# EAGLE design version_2 (EAGLE 6.1)
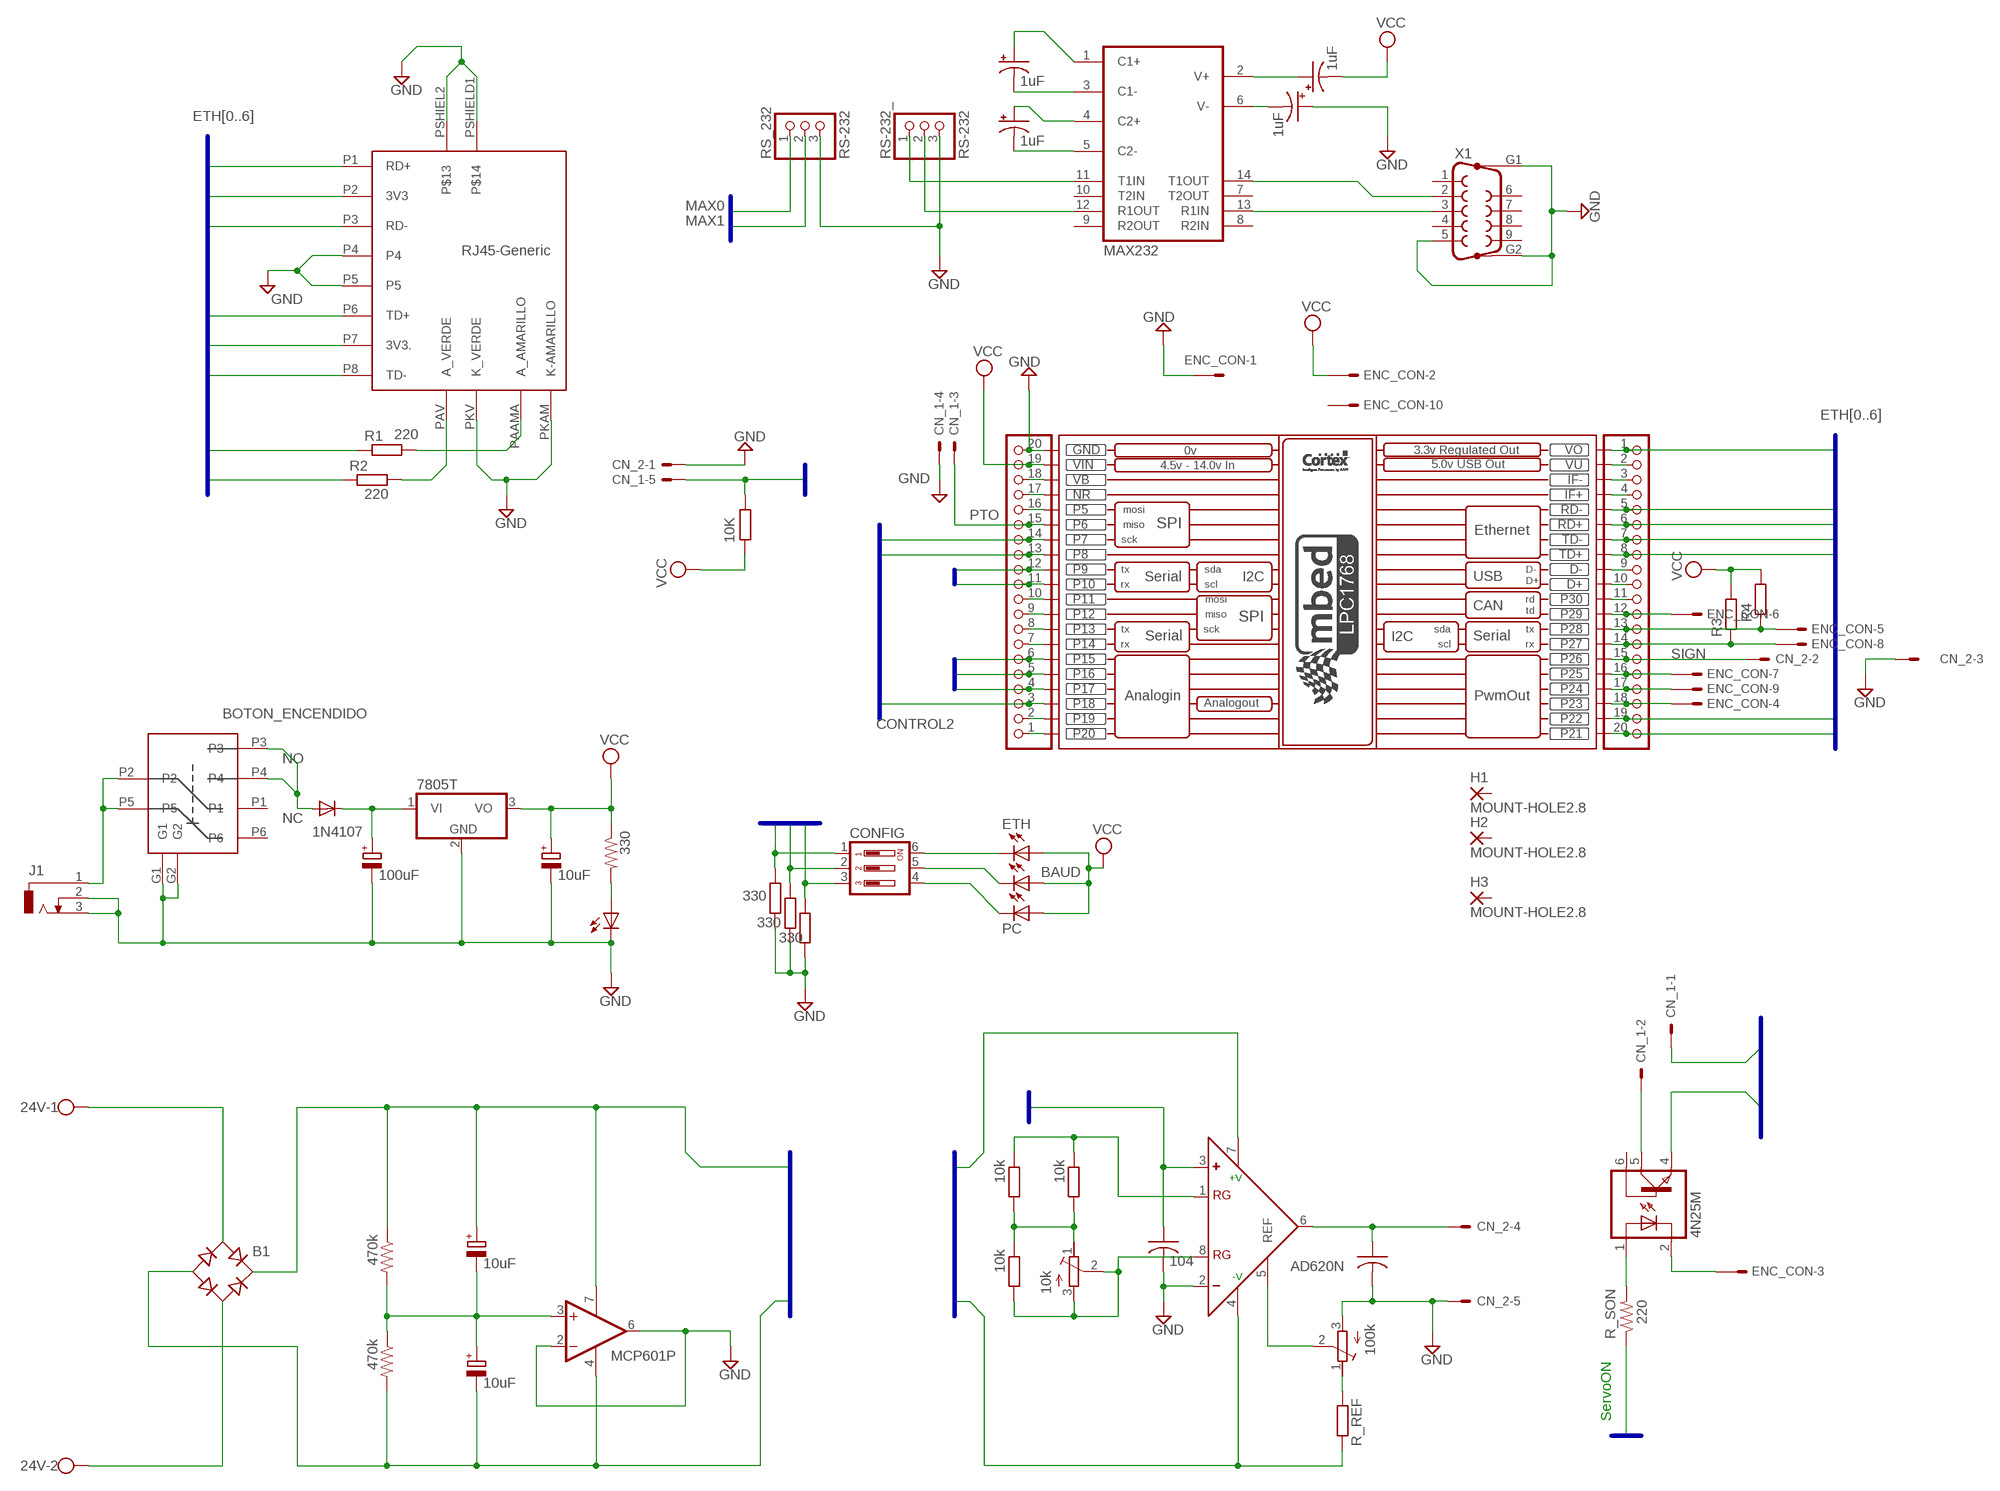
[diagram p0: schematic, sheet 1]

## Parts
24V  W237-02P  [W237-132]
B1  RB1A  [RB1A]
BAUD  LED3MM  [LED3MM]
C1_9V  100uF  CPOL-EUTT5D7  [TT5D7]
C1_+24  10uF  CPOL-EUTT5D7  [TT5D7]
C1_MAX  1uF  CPOL-USE2,5-6E  [E2,5-6E]
C2_0V  10uF  CPOL-EUTT5D7  [TT5D7]
C2_9V  10uF  CPOL-EUTT5D7  [TT5D7]
C2_MAX  1uF  CPOL-USE2,5-6E  [E2,5-6E]
C3_AOUT  C-US025-024X044  [C025-024X044]
C3_MAX  1uF  CPOL-USE2,5-6E  [E2,5-6E]
C4_MAX  1uF  CPOL-USE2,5-6E  [E2,5-6E]
C5_AOUT  104  C-US025-024X044  [C025-024X044]
CN_1  1  22-23-2051  [22-23-2051]
CN_2  2  22-23-2051  [22-23-2051]
CONFIG  DIP03YL  [DIP03YL]
D1_INPUT  1N4107  1N4148DO35-10  [DO35-10]
ENC_CON  057-010-1  [057-010-1]
ETH  LED3MM  [LED3MM]
H1  MOUNT-HOLE2.8  2,54/0,8  [2,54/0,8]
H2  MOUNT-HOLE2.8  2,54/0,8  [2,54/0,8]
H3  MOUNT-HOLE2.8  2,54/0,8  [2,54/0,8]
IC1  MAX232  [DIL16]
IC2  7805T  [TO220H]
IC3  MCP601P  [DIL08]
IC4  AD620N  [DIL08]
J1  DCJ0303  [DCJ0303]
JP_LEFT  PINHD-1X20  [1X20]
JP_RIGHT  PINHD-1X20  [1X20]
KIT1  MBED_NXP_LPC1768  [MBED-KIT]
OK1  4N25M  [DIL06]
PC  LED3MM  [LED3MM]
POT_G  10k  R-TRIMMT93XB  [RTRIMT93XB]
POT_REF  100k  R-TRIMMT93XB  [RTRIMT93XB]
PWR_LED  LED3MM  [LED3MM]
PWR_LED_R  330  R-US_0207/15  [0207/15]
R1  220  R-EU_0207/15  [0207/15]
R1_DIV  470k  R-US_0207/10  [0207/10]
R1_G  10k  R-EU_0207/2V  [0207/2V]
R2  220  R-EU_0207/15  [0207/15]
R2_DIV  470k  R-US_0207/10  [0207/10]
R2_G  10k  R-EU_0207/2V  [0207/2V]
R3  R-EU_0207/15  [0207/15]
R3_G  10k  R-EU_0207/2V  [0207/2V]
R4  R-EU_0207/15  [0207/15]
R13  330  R-EU_0207/15  [0207/15]
R14  330  R-EU_0207/15  [0207/15]
R15  330  R-EU_0207/15  [0207/15]
R16_ALM  10K  R-EU_0207/12  [0207/12]
R_REF  R-EU_0207/2V  [0207/2V]
R_SON  220  R-US_0207/7  [0207/7]
RS-232_  RS-232  PINHD-1X3  [1X03]
RS_232  RS-232  PINHD-1X3  [1X03]
U$1  RJ-45-GENERIC  [RJ45-GENERIC]
U$2  BOTON_ENCENDIDO  [BOTON_ENCNEDIDO]
X1  F09HP  [F09HP]

## Nets
24V0: B1.- C2_0V.- IC3.4(V-) IC4.4(-V) OK1.4(EMI) R2_DIV.2 R_REF.2
24V1: B1.+ C1_+24.+ CN_1.1 IC3.7(V+) IC4.7(+V) R1_DIV.1
CONFIG0: CONFIG.1 JP_LEFT.6 KIT1.P$15(P15) R15.2
CONFIG1: CONFIG.2 JP_LEFT.5 KIT1.P$16(P16) R14.2
CONFIG2: CONFIG.3 JP_LEFT.4 KIT1.P$17(P17) R13.2
CONTROL0: JP_LEFT.14 KIT1.P$7(P7) R_SON.1
CONTROL1: CN_1.5 JP_LEFT.13 KIT1.P$8(P8) R16_ALM.1
CONTROL2: C5_AOUT.1 IC4.3(+) JP_LEFT.3 KIT1.P$18(P18)
ETH0: JP_RIGHT.1 KIT1.VOUT(VO) U$1.P2(3V3) U$1.P7(3V3.)
ETH1: JP_RIGHT.5 KIT1.RD- U$1.P3(RD-)
ETH2: JP_RIGHT.6 KIT1.RD+ U$1.P1(RD+)
ETH3: JP_RIGHT.7 KIT1.TD- U$1.P8(TD-)
ETH4: JP_RIGHT.8 KIT1.TD+ U$1.P6(TD+)
ETH5: JP_RIGHT.19 KIT1.P$22(P22) R1.1
ETH6: JP_RIGHT.20 KIT1.P$21(P21) R2.1
GND: C1_9V.- C2_9V.- C3_AOUT.2 C3_MAX.+ C5_AOUT.2 CN_1.4 CN_2.1 CN_2.3 CN_2.5 ENC_CON.1 IC2.2(GND) IC3.2(-IN) IC3.6(OUT) IC4.2(-) J1.2 J1.3 JP_LEFT.20 KIT1.GND POT_REF.3(E) PWR_LED.K(C) R13.1 R14.1 R15.1 RS-232_.3 RS_232.3 U$1.P4 U$1.P5 U$1.PKAM(K-AMARILLO) U$1.PKV(K_VERDE) U$1.PSHIEL2 U$1.PSHIELD1 U$2.G1 U$2.G2 X1.5 X1.G1 X1.G2
MAX0: JP_LEFT.12 KIT1.P$9(P9) RS_232.1
MAX1: JP_LEFT.11 KIT1.P$10(P10) RS_232.2
N$1: 24V.1 B1.AC1
N$2: 24V.2 B1.AC2
N$3: C1_+24.- C2_0V.+ IC3.3(+IN) R1_DIV.2 R2_DIV.1
N$4: CN_1.2 OK1.5(COL)
N$5: JP_RIGHT.2 KIT1.VU
N$6: C3_AOUT.1 CN_2.4 IC4.6(OUT)
N$7: JP_RIGHT.3 KIT1.IF-
N$8: POT_REF.1(A) R_REF.1
N$9: IC4.1(RG) R1_G.1 R3_G.1
N$10: POT_G.1(A) R1_G.2 R2_G.1 R3_G.2
N$11: IC4.8(RG) POT_G.2(S) POT_G.3(E) R2_G.2
N$12: D1_INPUT.A U$2.P3 U$2.P4
N$14: JP_RIGHT.4 KIT1.IF+
N$15: IC4.5(REF) POT_REF.2(S)
N$16: JP_RIGHT.11 KIT1.P$30(P30)
N$18: J1.1 U$2.P2 U$2.P5
N$20: OK1.1(A) R_SON.2
N$21: C1_9V.+ D1_INPUT.C IC2.1(VI)
N$22: IC1.11(T1IN) RS-232_.1
N$23: IC1.12(R1OUT) RS-232_.2
N$24: CONFIG.6 ETH.K(C)
N$25: BAUD.K(C) CONFIG.5
N$26: CONFIG.4 PC.K(C)
N$31: JP_RIGHT.9 KIT1.D-
N$32: JP_RIGHT.10 KIT1.D+
N$33: C1_MAX.+ IC1.1(C1+)
N$34: C1_MAX.- IC1.3(C1-)
N$35: C2_MAX.- IC1.5(C2-)
N$36: C2_MAX.+ IC1.4(C2+)
N$37: C4_MAX.+ IC1.2(V+)
N$38: C3_MAX.- IC1.6(V-)
N$39: ENC_CON.5 JP_RIGHT.13 KIT1.P$28(P28) R4.1
N$40: IC1.14(T1OUT) X1.2
N$41: IC1.13(R1IN) X1.3
N$42: ENC_CON.4 JP_RIGHT.18 KIT1.P$23(P23)
N$44: ENC_CON.8 JP_RIGHT.14 KIT1.P$27(P27) R3.1
N$45: ENC_CON.7 JP_RIGHT.16 KIT1.P$25(P25)
N$46: R1.2 U$1.PAAMA(A_AMARILLO)
N$47: ENC_CON.9 JP_RIGHT.17 KIT1.P$24(P24)
N$48: JP_LEFT.18 KIT1.VB
N$49: JP_LEFT.17 KIT1.NR
N$50: JP_LEFT.16 KIT1.P$5(P5)
N$52: R2.2 U$1.PAV(A_VERDE)
N$53: JP_LEFT.10 KIT1.P$11(P11)
N$54: JP_LEFT.9 KIT1.P$12(P12)
N$55: JP_LEFT.8 KIT1.P$13(P13)
N$57: JP_LEFT.7 KIT1.P$14(P14)
N$58: ENC_CON.3 OK1.2(C)
N$59: JP_LEFT.2 KIT1.P$19(P19)
N$60: JP_LEFT.1 KIT1.P$20(P20)
N$61: PWR_LED.A PWR_LED_R.2
PTO: CN_1.3 JP_LEFT.15 KIT1.P$6(P6)
SIGN: CN_2.2 JP_RIGHT.15 KIT1.P$26(P26)
SIGN+: ENC_CON.6 JP_RIGHT.12 KIT1.P$29(P29)
VCC: BAUD.A C2_9V.+ C4_MAX.- ENC_CON.2 ETH.A IC2.3(VO) JP_LEFT.19 KIT1.VIN PC.A PWR_LED_R.1 R3.2 R4.2 R16_ALM.2
Unconnected: ENC_CON.10 H1.1(P) H2.1(P) H3.1(P) IC1.7(T2OUT) IC1.8(R2IN) IC1.9(R2OUT) IC1.10(T2IN) OK1.6(BAS) U$2.P1 U$2.P6 X1.1 X1.4 X1.6 X1.7 X1.8 X1.9

## Buses
ETH[0..6]
MAX[0..1]
CONTROL[0..2]
24V[0..1]
CONFIG[0..2]

## Notes on the sheet
- ServoON

## Power pins joined to a net without a drawn wire
GND: IC1.15(GND)
VCC: IC1.16(VCC)

## Library data of the parts
24V = con-wago-508:W237-02P: WAGO SREW CLAMP
B1 = rectifier:RB1A: RECTIFIER 1 A
BAUD ETH PC PWR_LED = led:LED: LED OSRAM: - CHIPLED LG R971, LG N971, LY N971, LG Q971, LY Q971, LO R971, LY R971 LH N974, LH R974 LS Q976, LO Q976, LY Q976 LO Q996 - Hyper CHIPLED LW Q18S LB Q993, LB Q99A, LB R99A - SideLED LS A670, LO A670, LY A670, LG A670, LP A670 LB A673, LV A673, LT A673, LW A673 LH A674 LY A675 LS A676, LA A676, LO A676, LY A676, LW A676 LS A679, LY A679, LG A679 - Hyper Micro SIDELED® LS Y876, LA Y876, LO Y876, LY Y876 LT Y87S - SmartLED LW L88C, LW L88S LB L89C, LB L89S, LG L890 LS L89K, LO L89K, LY L89K LS L896, LA L896, LO L896, LY L896 - TOPLED LS T670, LO T670, LY T670, LG T670, LP T670 LSG T670, LSP T670, LSY T670, LOP T670, LYG T670 LG T671, LOG T671, LSG T671 LB T673, LV T673, LT T673, LW T673 LH T674 LS T676, LA T676, LO T676, LY T676, LB T676, LH T676, LSB T676, LW T676 LB T67C, LV T67C, LT T67C, LS T67K, LO T67K, LY T67K, LW E67C LS E67B, LA E67B, LO E67B, LY E67B, LB E67C, LV E67C, LT E67C LW T67C LS T679, LY T679, LG T679 LS T770, LO T770, LY T770, LG T770, LP T770 LB T773, LV T773, LT T773, LW T773 LH T774 LS E675, LA E675, LY E675, LS T675 LS T776, LA T776, LO T776, LY T776, LB T776 LHGB T686 LT T68C, LB T68C - Hyper Mini TOPLED® LB M676 - Mini TOPLED Santana® LG M470 LS M47K, LO M47K, LY M47K Source: http://www.osram.convergy.de LUXEON: - LUMILED® LXK2-PW12-R00, LXK2-PW12-S00, LXK2-PW14-U00, LXK2-PW14-V00 LXK2-PM12-R00, LXK2-PM12-S00, LXK2-PM14-U00 LXK2-PE12-Q00, LXK2-PE12-R00, LXK2-PE12-S00, LXK2-PE14-T00, LXK2-PE14-U00 LXK2-PB12-K00, LXK2-PB12-L00, LXK2-PB12-M00, LXK2-PB14-N00, LXK2-PB14-P00, LXK2-PB14-Q00 LXK2-PR12-L00, LXK2-PR12-M00, LXK2-PR14-Q00, LXK2-PR14-R00 LXK2-PD12-Q00, LXK2-PD12-R00, LXK2-PD12-S00 LXK2-PH12-R00, LXK2-PH12-S00 LXK2-PL12-P00, LXK2-PL12-Q00, LXK2-PL12-R00 Source: www.luxeon.com KINGBRIGHT: KA-3528ASYC Source: www.kingbright.com
C1_9V C1_+24 C2_0V C2_9V = rcl:CPOL-EU: POLARIZED CAPACITOR, European symbol
C1_MAX C2_MAX C3_MAX C4_MAX = rcl:CPOL-US: POLARIZED CAPACITOR, American symbol
C3_AOUT C5_AOUT = rcl:C-US: CAPACITOR, American symbol
CN_1 CN_2 = con-molex:22-23-2051: .100" (2.54mm) Center Header - 5 Pin
CONFIG = switch-dil:DIP03YL: DIL/CODE SWITCH
D1_INPUT = diode:1N4148: DIODE high speed (Philips)
ENC_CON = con-panduit:057-010-: CONNECTOR 10-pin series 057 contact pc board low profile headers; OC_FARNELL: unknown; OC_NEWARK: unknown
H1-H3 = wirepad:2,54/0,8: THROUGH-HOLE PAD
IC1 = maxim:MAX232: RS232 TRANSEIVER
IC2 = linear:78*: Positive VOLTAGE REGULATOR Source: http://cache.national.com/ds/LM/LM78L05.pdf http://www.fairchildsemi.com/ds/LM/LM7805.pdf
IC3 = linear:MCP601: Single Op Amp 2.7V to 6.0V Single Supply CMOS Source: http://ww1.microchip.com/downloads/en/DeviceDoc/21314g.pdf
IC4 = analog-devices:AD620: Low Cost, Low Power, Instrumentation Amplifier Source: http://www.analog.com/UploadedFiles/Data_Sheets/37793330023930AD620_e.pdf
J1 = con-jack:DCJ0303: DC POWER JACK Source: DCJ0303.pdf
JP_LEFT JP_RIGHT = pinhead:PINHD-1X20: PIN HEADER
KIT1 = MBED_v2.1:MBED_NXP_LPC1768: Mbed LPC1768 - ARM CORTEX v2.1 * Schematic symbol is now placed in eagles's default raster. *The pads diameter are suitable for routing between mbed pins * mbed pads are 0.8 mm drill diameter. --------------------------------------------- Created by: Mohamed Yousry *Alexandria, Egypt *Email: mohamed.yousry@ieeegoldegypt.org
OK1 = optocoupler:4N*?M: General Purpose 6-Pin Phototransistor Optocouplers Source: http://www.fairchildsemi.com/ds/4N/4N35-M.pdf
POT_G POT_REF = rcl:R-TRIMM: Trimm resistor
PWR_LED_R R_SON = rcl:R-US_: RESISTOR, American symbol
R1 R1_G R2 R2_G R3 R3_G R4 R13-R15 R16_ALM R_REF = rcl:R-EU_: RESISTOR, European symbol
R1_DIV R2_DIV = resistor:R-US_: RESISTOR, American symbol
RS-232_ RS_232 = pinhead:PINHD-1X3: PIN HEADER
U$1 = RJ45:RJ-45-GENERIC
U$2 = Boton_Encendido:BOTON_ENCENDIDO
X1 = con-subd:F09HP: SUB-D

## Board
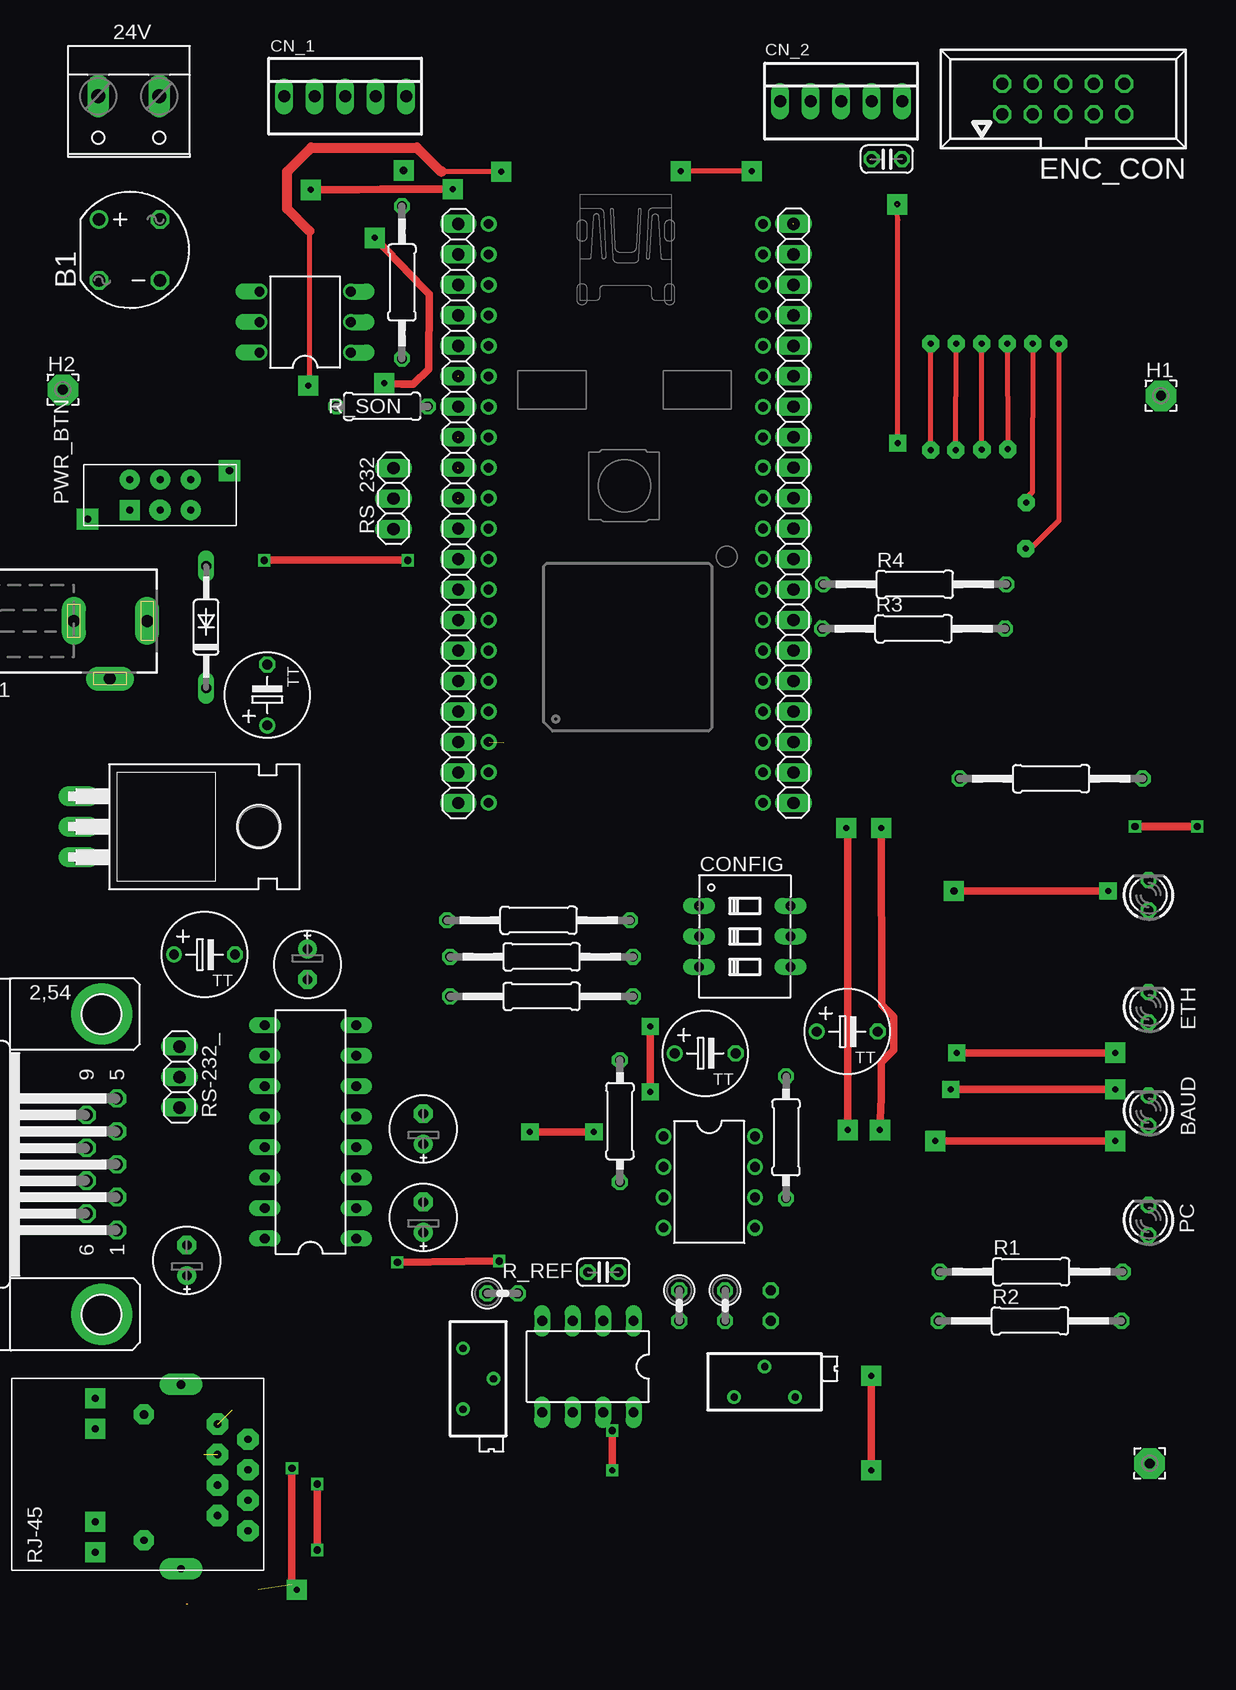
[diagram p1: board, top side]
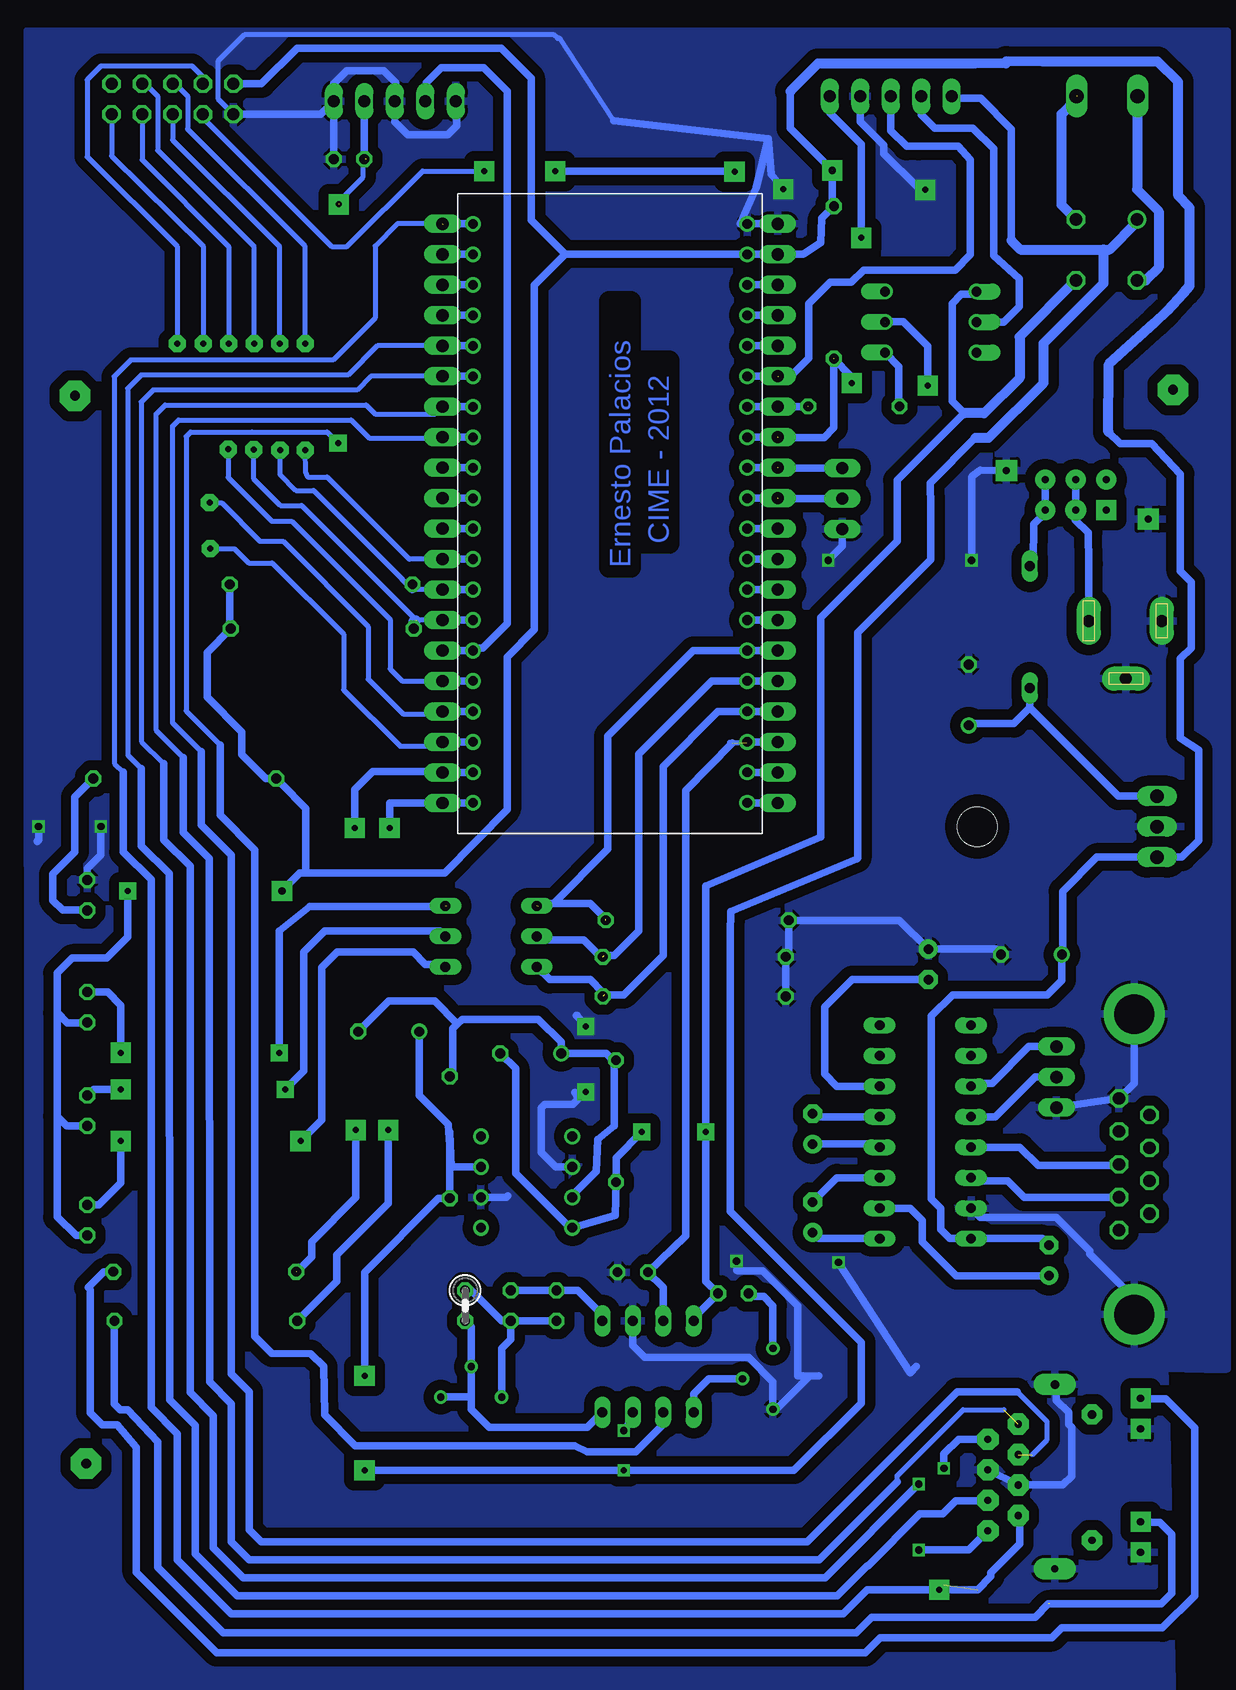
[diagram p2: board, bottom side, seen from below]

No outline drawn. Coordinates in mm, seen from the top.
Copper layers (1*16): Top 0.035mm / dielectric 1.5mm / Bottom 0.035mm
Design rules: minimum track width 10mil, minimum drill 24mil, track to track 34mil, track to pad 34mil, pad to pad 34mil, via to via 34mil, smd to smd 34mil, copper to edge 40mil, drill to drill 8mil, minimum pad ring 10mil, minimum via ring 8mil, stop-mask expansion 4mil, vias tented up to drill 0mil, thermal gap 10mil

### Footprints (pad centres in the part's own frame; a part is rotated, then mirrored left to right if it is on the bottom)
W237-132 = drill 1.194 long: 1 -2.54,-0.635; 2 2.54,-0.635
RB1A = drill 1.016: + -2.54,2.54 | drill 1.016 octagon: - 2.54,-2.54; AC1 2.54,2.54; AC2 -2.54,-2.54
LED3MM = drill 0.813 octagon: A -1.27,0; K 1.27,0
TT5D7 = drill 0.813: + -2.54,0 | drill 0.813 octagon: - 2.54,0
E2,5-6E = drill 0.813 pad 1.575: + -1.27,0 | drill 0.813 pad 1.575 octagon: - 1.27,0
C025-024X044 = drill 0.813 octagon: 1 -1.27,0; 2 1.27,0
22-23-2051 = drill 1 long: 1 -5.08,0; 2 -2.54,0; 3 0,0; 4 2.54,0; 5 5.08,0
DIP03YL = drill 0.813 long: 1 -2.54,-3.81; 2 0,-3.81; 3 2.54,-3.81; 4 2.54,3.81; 5 0,3.81; 6 -2.54,3.81
DO35-10 = drill 0.813 long: A 5.08,0; C -5.08,0
057-010-1 = drill 1 octagon: 1 -5.08,-1.27; 2 -5.08,1.27; 3 -2.54,-1.27; 4 -2.54,1.27; 5 0,-1.27; 6 0,1.27; 7 2.54,-1.27; 8 2.54,1.27; 9 5.08,-1.27; 10 5.08,1.27
2,54/0,8 = drill 0.813 pad 2.54 octagon: 1 0,0
DIL16 = drill 0.813 long: 1 -8.89,-3.81; 2 -6.35,-3.81; 3 -3.81,-3.81; 4 -1.27,-3.81; 5 1.27,-3.81; 6 3.81,-3.81; 7 6.35,-3.81; 8 8.89,-3.81; 9 8.89,3.81; 10 6.35,3.81; 11 3.81,3.81; 12 1.27,3.81; 13 -1.27,3.81; 14 -3.81,3.81; 15 -6.35,3.81; 16 -8.89,3.81
TO220H = drill 1.118 long: 1 -2.54,-10.16; 2 0,-10.16; 3 2.54,-10.16 | hole 3.302: 0,4.826
DIL08 = drill 0.813 pad 1.27: 1 -3.81,-3.81; 2 -1.27,-3.81; 3 1.27,-3.81; 4 3.81,-3.81; 5 3.81,3.81; 6 1.27,3.81; 7 -1.27,3.81; 8 -3.81,3.81
DIL08' = drill 0.813 long: 1 -3.81,-3.81; 2 -1.27,-3.81; 3 1.27,-3.81; 4 3.81,-3.81; 5 3.81,3.81; 6 1.27,3.81; 7 -1.27,3.81; 8 -3.81,3.81
DCJ0303 = drill 1 pad 2 long: 1 0,3.1; 2 4.8,0; 3 0,-3
1X20 = drill 1.016 long: 1 -24.13,0; 2 -21.59,0; 3 -19.05,0; 4 -16.51,0; 5 -13.97,0; 6 -11.43,0; 7 -8.89,0; 8 -6.35,0; 9 -3.81,0; 10 -1.27,0; 11 1.27,0; 12 3.81,0; 13 6.35,0; 14 8.89,0; 15 11.43,0; 16 13.97,0; 17 16.51,0; 18 19.05,0; 19 21.59,0; 20 24.13,0
MBED-KIT = drill 0.8: D+ 11.43,1.27; D- 11.43,3.81; GND -11.43,24.13; IF+ 11.43,16.51; IF- 11.43,19.05; NR -11.43,16.51; P$5 -11.43,13.97; P$6 -11.43,11.43; P$7 -11.43,8.89; P$8 -11.43,6.35; P$9 -11.43,3.81; P$10 -11.43,1.27; P$11 -11.43,-1.27; P$12 -11.43,-3.81; P$13 -11.43,-6.35; P$14 -11.43,-8.89; P$15 -11.43,-11.43; P$16 -11.43,-13.97; P$17 -11.43,-16.51; P$18 -11.43,-19.05; P$19 -11.43,-21.59; P$20 -11.43,-24.13; P$21 11.43,-24.13; P$22 11.43,-21.59; P$23 11.43,-19.05; P$24 11.43,-16.51; P$25 11.43,-13.97; P$26 11.43,-11.43; P$27 11.43,-8.89; P$28 11.43,-6.35; P$29 11.43,-3.81; P$30 11.43,-1.27; RD+ 11.43,11.43; RD- 11.43,13.97; TD+ 11.43,6.35; TD- 11.43,8.89; VB -11.43,19.05; VIN -11.43,21.59; VOUT 11.43,24.13; VU 11.43,21.59
DIL06 = drill 0.813 offset: 1 -2.54,-3.81; 2 0,-3.81; 3 2.54,-3.81; 4 2.54,3.81; 5 0,3.81; 6 -2.54,3.81
RTRIMT93XB = drill 0.61: 1 1.27,-2.54; 2 -1.27,0; 3 1.27,2.54
0207/15 = drill 0.813 octagon: 1 -7.62,0; 2 7.62,0
0207/10 = drill 0.813 octagon: 1 -5.08,0; 2 5.08,0
0207/2V = drill 0.813 octagon: 1 -1.27,0; 2 1.27,0
0207/12 = drill 0.813 octagon: 1 -6.35,0; 2 6.35,0
0207/7 = drill 0.813 octagon: 1 -3.81,0; 2 3.81,0
1X03 = drill 1.016 long: 1 -2.54,0; 2 0,0; 3 2.54,0
RJ45-GENERIC = drill 0.6 pad 1.778 octagon: P1 12.2,19.685; P2 10.93,17.145; P3 9.66,19.685; P4 8.39,17.145; P5 7.12,19.685; P6 5.85,17.145; P7 4.58,19.685; P8 3.31,17.145 | drill 0.6 pad 1.676 square: PAAMA 1.17,6.958; PAV 11.465,6.958; PKAM 3.71,6.958; PKV 14.005,6.958 | drill 0.6 pad 1.778 long: PSHIEL2 15.375,14.105 | drill 0.7 pad 1.778 long: PSHIELD1 0,14.105 | drill 0.7 pad 1.676 octagon: PSTAND 2.5,11.008 | drill 0.6 pad 1.676 octagon: PSTAND2 13,11.008
BOTON_ENCNEDIDO = drill 0.6 pad 1.778 square: G1 -2.019,6.039; G2 2.018,-5.785 | drill 0.6 pad 1.676 square: P1 -1.27,2.54 | drill 0.6 pad 1.778: P2 -1.27,0 | drill 0.6 pad 1.676: P3 -1.27,-2.54; P4 1.27,-2.54; P5 1.27,0; P6 1.27,2.54
F09HP = drill 1.016 octagon: 1 -5.486,-1.27; 2 -2.743,-1.27; 3 0,-1.27; 4 2.743,-1.27; 5 5.486,-1.27; 6 -4.115,1.27; 7 -1.372,1.27; 8 1.372,1.27; 9 4.115,1.27 | drill 3.302 pad 5.08: G1 -12.522,0; G2 12.522,0

### Placement (x,y rotation side)
24V  10,126.86 180 top
B1  10.06,114.68 0 top
BAUD  94.98,42.92 90 top
C1_9V  21.54,77.58 90 top
C1_+24  69.87,49.51 0 top
C1_MAX  34.54,34.04 90 top
C2_0V  58.04,47.7 0 top
C2_9V  16.31,55.94 0 top
C2_MAX  34.54,41.4 90 top
C3_AOUT  73.17,122.24 0 top
C3_MAX  24.89,55.12 270 top
C4_MAX  14.84,30.44 90 top
C5_AOUT  49.53,29.46 0 top
CN_1  28.03,127.48 0 top
CN_2  69.36,127.07 0 top
CONFIG  61.34,57.45 270 top
D1_INPUT  16.45,83.23 90 top
ENC_CON  87.88,127.25 0 top
ETH  94.98,51.54 90 top
H1  96.01,102.52 0 top
H2  4.5,103.02 0 top
H3  95.08,13.51 0 top
IC1  25.15,41.15 90 top
IC2  15.99,66.6 270 top
IC3  58.37,36.97 270 top
IC4  AD620N  [DIL08']  48.26,21.59 180 top
J1  8.43,83.74 270 top
JP_LEFT  37.45,92.71 90 top
JP_RIGHT  65.39,92.71 270 top
KIT1  51.42,92.71 0 top
OK1  24.69,108.66 90 top
PC  94.98,33.8 90 top
POT_G  62.99,20.32 270 top
POT_REF  39.12,20.57 180 top
PWR_LED  94.98,60.89 90 top
PWR_LED_R  86.86,70.6 0 top
R1  85.2,29.5 0 top
R1_DIV  64.77,40.7 90 top
R1_G  59.69,26.67 270 top
R2  85.1,25.4 0 top
R2_DIV  50.93,42.05 270 top
R2_G  63.5,26.67 270 bottom
R3  75.4,83.1 0 top
R3_G  55.88,26.67 270 top
R4  75.5,86.8 0 top
R13  44.4,52.45 0 top
R14  44.4,55.75 0 top
R15  44.15,58.8 0 top
R16_ALM  32.77,111.97 90 top
R_REF  41.15,27.69 0 top
R_SON  31.11,101.63 180 top
RS-232_  14.22,45.72 270 top
RS_232  32.07,93.95 270 top
U$1  0.25,20.11 270 top
U$2  12.61,94.25 90 top
X1  7.74,38.45 90 top

### Tracks (layer width: path | path; a pad name or v marks a point on that pad's centre or on a via)
24V0  (via drill 0.5 pad 1.42)
  Top 0.61: v43.43,41.15 v48.77,41.15
  Bottom 0.61: OK1.4 21.11,110.97 22.16,110.97 22.92,110.2 22.92,102.08 21.91,101.06 27.5,95.47 27.5,90.39 33.85,84.04 33.85,65.75 43.43,61.67 v43.43,41.15 43.43,28.7 R_REF.2 44.45,25.65 IC4.4 | v48.77,41.15 50.93,38.99 R2_DIV.2 51.01,34.18 IC3.4 54.75,33.16 59.3,37.71 59.3,46.42 C2_0V.-
  Bottom 0.813: B1.- 17.3,107.43 17.3,104 20.24,101.06 21.91,101.06
24V1  (via drill 0.5 pad 1.02, 0.5 pad 1.68, 0.6)
  Top 0.61: v71.88,12.95 v71.88,20.83 | v50.29,16.26 v50.29,12.95
  Bottom 0.61: 20.99,99.01 24.75,95.25 24.7,93.19 24.7,88.87 30.8,82.77 30.8,63.98 30.86,63.91 41.38,59.53 41.4,57.66 41.4,34.54 30.48,23.62 30.48,18.54 36.1,12.95 v50.29,12.95 v71.88,12.95 | 64.64,38.23 64.77,41.15 R1_DIV.1 65.72,35.62 71.88,29.46 v71.88,20.83 | 64.64,38.23 63.36,38.24 IC3.7 | C1_+24.+ 67.31,49.5 67.31,44.2 64.9,41.78 64.64,38.23 | IC4.7 49.53,17.27 v50.29,16.26 | 17.97,115.45 17.97,124.72 20.55,127.3 22.77,127.3 CN_1.1
  Bottom 0.813: 17.97,115.45 17.22,114.7 10.3,114.7 | 10.3,114.7 9.8,114.7 7.52,116.98 B1.+ | 20.99,99.01 19.88,99.01 15.3,103.59 15.3,106.9 10.3,111.9 10.3,114.7
AOUT
  Bottom 0.406: 41.46,73.63 40,73.63 40,73.6
CONFIG0  (2 unrouted)
  Bottom 0.61: 51.77,58.88 53.09,60.2 56.13,60.2 | 56.13,60.2 57.15,60.2 57.4,59.94 | JP_LEFT.6 KIT1.P$15 44.48,81.28 51.6,74.16 51.6,64.73 56.13,60.2
CONFIG1  (1 unrouted)
  Bottom 0.61: JP_LEFT.5 KIT1.P$16 42.94,78.74 49.04,72.64 49.04,57.9 51.05,55.88 51.89,55.88 | R14.2 52.19,55.75 53.59,57.15 57.23,57.15 CONFIG.2
CONFIG2  (1 unrouted)
  Bottom 0.61: JP_LEFT.4 KIT1.P$17 42.43,76.2 47.01,71.63 47.01,55.86 50.29,52.58 51.89,52.58 | R13.2 52.02,52.79 53.09,53.85 56.47,53.85 CONFIG.3
CONTROL0  (1 unrouted)
  Bottom 0.61: KIT1.P$7 JP_LEFT.14 34.95,101.6
CONTROL1  (via drill 0.5 pad 1.68)  (2 unrouted)
  Top 0.61: v30.49,115.68 34.54,111.5 35.05,110.99 35,104.75 33.72,103.47 32.7,103.47 v31.29,103.56
  Bottom 0.61: JP_LEFT.13 KIT1.P$8 | CN_1.5 33.13,126.15 33.1,126.1 30.5,123.5 30.5,121.52 v30.49,115.68 | R16_ALM.1 32.77,99.85 33.59,99.03 37.42,99.03 | v31.29,103.56 31.31,104.11 32.83,105.63
CONTROL2  (1 unrouted)
  Bottom 0.61: 40.02,73.63 KIT1.P$18 JP_LEFT.3 | 41.23,73.57 45.1,69.6 45.13,32.5 C5_AOUT.1 46.99,28.19 IC4.3
ETH0  (via drill 0.5 pad 1.68, 0.6)  (2 unrouted)
  Top 0.61: v23.6,13.1 23.6,3.4 v24,3
  Bottom 0.406: JP_RIGHT.1 69.16,116.84 71,115 71,109 74.5,105.5 91.38,105.5 92.75,104.12 92.72,71.88 92,71.15
  Bottom 0.61: KIT1.VOUT 65.31,116.84 65.34,116.81 | 92,71.15 92,64.5 89.67,62.17 89.67,18.18 87.5,16 87.5,5.5 83,1 32,1 30,3 20.8,3 19.7,4.1 19.7,4.4 17.3,6.8 17.3,9.08 U$1.P2 | U$1.P7 22.37,15.53 23.6,14.3 v23.6,13.1
ETH1
  Bottom 0.406: KIT1.RD- 70.82,106.68 73.25,104.25 90.5,104.25 91.62,103.12 91.6,72.55 90.5,71.45
  Bottom 0.61: KIT1.RD- JP_RIGHT.5 | 90.5,71.45 90.5,65 88.17,62.7 88.12,18.8 86,16.68 86,6 82.5,2.5 32.5,2.5 30,5 29.9,5 25.6,9.3 23.7,9.3 22.6,10.4 19.98,10.4 U$1.P3
ETH2  (via drill 0.6)
  Top 0.61: v25.7,11.8 v25.7,6.3
  Bottom 0.406: KIT1.RD+ 71.36,104.14 72.5,103 89.5,103 90.5,102 90.47,73.7 88.62,71.85
  Bottom 0.61: KIT1.RD+ JP_RIGHT.6 | 88.62,71.85 88.62,65.5 86.42,63.3 86.42,19.43 84.5,17.5 84.5,6.5 82,4 33.5,4 v25.7,11.8 | v25.7,6.3 21.55,6.3 U$1.P1
ETH3  (1 unrouted)
  Bottom 0.406: 87,72.38 89.22,74.62 89.25,101 88.5,101.75 71.75,101.75 71,101 65.99,101 JP_RIGHT.7 | 27.5,12 27.5,12.5 22,18 18.6,18
  Bottom 0.61: KIT1.TD- JP_RIGHT.7 | 27.5,12 34,5.5 81.5,5.5 83,7 83,18.5 84.8,20.3 84.83,63.95 87,66.12 87,72.38
ETH4  (1 unrouted)
  Bottom 0.406: 16.24,14.26 15,15.5 15,17 17.5,19.5 | 85.5,72.88 87.88,75.25 87.88,100 87.38,100.5 73,100.5 71.5,99 65.45,99 JP_RIGHT.8
  Bottom 0.61: KIT1.TD+ JP_RIGHT.8 | 17.5,19.5 22.5,19.5 35,7 80.5,7 81.5,8 81.5,19.5 83,21 83,64.25 85.5,66.75 85.5,72.88
ETH5  (via drill 0.5 pad 1.68)  (1 unrouted)
  Top 0.61: v72.6,41.3 72.7,44 72.7,46.95 73.75,48 73.75,50.75 72.75,51.75 v72.7,66.5
  Bottom 0.406: 76.3,30.78 76.3,30.75
  Bottom 0.61: KIT1.P$22 JP_RIGHT.19 65.47,71.2 71.2,71.2 72.7,69.7 v72.7,66.5 | 76.3,30.78 76.3,32 72.6,35.7 v72.6,41.3 | 76.3,30.75 77.55,29.5
ETH6  (via drill 0.5 pad 1.68)
  Top 0.61: v69.9,41.3 69.9,66.5 v69.8,66.5
  Bottom 0.61: KIT1.P$21 JP_RIGHT.20 69.8,68.58 v69.8,66.5 | v69.9,41.3 69.9,35.2 74.2,30.9 74.2,28.68 R2.1
GND  (via drill 0.5 pad 1.42, 0.5 pad 1.68, 0.6)
  Top 0.61: v40.88,30.38 v32.39,30.28 | v25.16,119.68 29.18,119.68 31,119.75 v37,119.75 | v33.25,88.8 v21.3,88.8 | v53.45,44.5 v53.45,49.95 | v93.85,66.6 v99.05,66.6
  Bottom 0.406: 51.1,125.45 55.6,132.3 55.8,132.3 56.1,132.6 81.9,132.6 84.1,130.4 84.1,127.28 ENC_CON.1
  Bottom 0.61: C3_AOUT.2 CN_2.5 74.44,128.51 73.34,129.61 70.3,129.61 69.28,128.59 69.28,126.82 69.53,127.07 | 69.36,125.37 68.26,124.28 64.96,124.28 64.2,125.04 64.2,126.99 CN_2.1 | U$1.P5 U$1.P4 13.68,11.72 12.95,12.45 12.95,16.51 13.21,16.76 13.21,17.78 14.22,18.8 14.22,19.81 14.48,20.07 14.22,20.07 | R13.1 R14.1 36.53,56 R15.1 27.3,58.8 C3_MAX.+ 19.3,56.39 C2_9V.- | X1.G1 7.74,27.3 11.43,30.99 11.43,31.24 14.22,34.04 20.57,34.04 IC1.15 | RS-232_.3 X1.5 7.74,45.21 X1.G2 | IC4.2 49.53,23.37 48.51,22.35 39.88,22.35 37.85,20.32 POT_REF.3 37.59,18.03 34.8,20.83 | JP_LEFT.20 KIT1.GND 40.59,116.84 39.25,119.85 38.25,123.95 | 54.1,43.94 54.36,44.45 | 34.8,20.83 34.04,20.83 | 34.8,20.83 35.8,20.83 35.8,26.65 38.7,29.55 40.8,29.55 40.85,29.6 40.85,30.4 v40.88,30.38 | v32.39,30.28 26.42,21.08 25.91,21.59 | v25.16,119.68 25.3,119.68 25.79,119.94 | IC3.6 60.05,35.7 59.94,35.81 | ENC_CON.1 75.52,125.98 74.5,127 | CN_1.4 30.57,125.37 28.6,123.4 28.6,122.7 25.8,119.9 | v37,119.75 38,121 38.25,123.95 | 38.25,123.95 51.1,125.45 | RS_232.3 32.07,89.98 v33.25,88.8 | v21.3,88.8 21.3,95.75 21.25,95.8 20.57,96.3 U$2.G2 | IC3.2 55.94,38.24 57.15,39.45 57.15,43.15 56.85,43.45 54.55,43.45 53.75,44.25 53.7,44.25 v53.45,44.5 | v53.45,49.95 53.45,50.05 54.25,50.85 54.15,50.85 | PWR_LED.K 94.98,63.12 93.85,64.25 v93.85,66.6 | v99.05,66.6 99.05,65.5 99.15,65.4 99.15,65.35
  pour Bottom: 0,21.39 0,132.89 99.98,132.94 99.98,132.94 99.93,-6.45 99.58,-6.71 4.52,-6.61 4.51,-6.8 5.06,18.28 5.21,21.44 0.25,21.34
MAX0  (1 unrouted)
  Bottom 0.61: JP_LEFT.12 KIT1.P$9 | RS_232.1 37.42,96.49
MAX1  (1 unrouted)
  Bottom 0.61: JP_LEFT.11 KIT1.P$10 | RS_232.2 37.42,93.95
N$1  (1 unrouted)
  Bottom 0.813: B1.AC1 13.8,118.42 13.8,126 12.6,127.2 12.6,127.5 12.5,127.5
N$2
  Bottom 0.813: 24V.2 7.5,127.45 7.5,119.7 5.7,117.9 5.7,113.2 6.76,112.14 B1.AC2
N$3
  Bottom 0.61: IC3.3 54.56,35.86 52.58,37.85 52.43,40.53 51.05,41.66 51.05,47.01 | 51.05,47.01 R2_DIV.1 | 51.05,47.01 51.75,47.7 C2_0V.+ 55.5,48.64 57.4,50.55 63.75,50.55 64.14,50.16 | 64.14,50.16 64.52,49.78 64.52,46.04 R1_DIV.2 | C1_+24.- 69.85,52.07 66.04,52.07 64.14,50.16
N$4
  Bottom 0.61: OK1.5 18.63,108.66 17.34,109.95 17.34,112.27 19.46,114.19 19.45,123.1 21.2,124.8 23.61,124.8 24.35,124.8 25.49,125.94 CN_1.2
N$5
  Bottom 0.61: KIT1.VU JP_RIGHT.2
N$6  (via drill 0.5 pad 1.42, 0.5 pad 1.68)  (2 unrouted)
  Top 0.406: v74.09,98.58 74.09,117.16 74,118.5
  Bottom 0.406: 83.92,73.42 86.75,76.25 86.75,99.12 86.38,99.5 81.25,99.5 75,99.49 v74.09,98.58 | v74.04,118.47 74.04,118.71 72,120.75 72,122.25 71.75,122.25
  Bottom 0.61: CN_2.4 C3_AOUT.1 71.82,122.24 | 83.92,73.42 83.92,67.56 81.03,64.67 81.03,24.13 79.6,22.7 76.35,22.67 75.28,21.61 75.18,17.55 72.64,14.99 54.36,14.99 53.34,14.48 49.28,14.48 46.99,16.76 IC4.6
N$7
  Bottom 0.61: KIT1.IF- JP_RIGHT.3
N$8
  Bottom 0.61: POT_REF.1 37.85,26.67 38.61,27.43 39.62,27.43 R_REF.1
N$9
  Bottom 0.61: R1_G.1 R3_G.1 54.1,27.94 52.32,26.16 52.32,25.65 IC4.1
N$10
  Bottom 0.61: POT_G.1 60.45,23.11 59.69,23.88 R1_G.2 R3_G.2 60.45,25.4 62.99,27.94 R2_G.1
N$11
  Bottom 0.61: IC4.8 53.34,16.51 61.47,16.51 62.99,18.03 62.99,18.94 | 62.99,18.94 POT_G.2 62.99,24.89 R2_G.2 | POT_G.3 63.1,19.05 62.99,18.94
N$12
  Bottom 0.61: U$2.P4 U$2.P3 15.15,92.75 16.1,91.8 16.15,88.61 D1_INPUT.A
N$14
  Bottom 0.61: KIT1.IF+ JP_RIGHT.4
N$15
  Bottom 0.61: POT_REF.2 43.18,20.57 44.45,19.3 IC4.5
N$16
  Bottom 0.61: KIT1.P$30 JP_RIGHT.11
N$18
  Bottom 0.61: J1.1 11.53,88.49 11.56,91.12 12.66,92.13 U$2.P2 U$2.P5
N$20
  Bottom 0.61: OK1.1 28.5,106.1 27.35,104.95 27.35,101.68 R_SON.2
N$21
  Bottom 0.61: D1_INPUT.C 16.45,76.52 | 16.45,76.52 17.78,75.18 21.39,75.18 C1_9V.+ | IC2.1 9.06,69.14 16.45,76.52
N$22
  Bottom 0.61: RS-232_.1 16.51,48.26 19.56,45.21 21.08,45.21 IC1.11
N$23
  Bottom 0.61: IC1.12 19.3,42.42 16,45.72 RS-232_.2
N$24  (via drill 0.5 pad 1.42, 0.5 pad 1.68)  (1 unrouted)
  Top 0.61: v92.2,47.75 v78.99,47.75
  Bottom 0.61: v78.99,47.75 78.99,57.91 76.45,59.94 65.02,59.94 | v92.2,47.75 92.2,51.7 93.3,52.8 ETH.K
N$25  (via drill 0.5 pad 1.42, 0.5 pad 1.68)
  Top 0.61: v92.2,44.7 v78.49,44.7
  Bottom 0.61: v78.49,44.7 76.96,46.23 76.96,56.13 75.18,57.91 65.61,57.91 CONFIG.5 | v92.2,44.7 94.47,44.7 BAUD.K
N$26  (via drill 0.5 pad 1.68)
  Top 0.61: v92.2,40.39 v77.22,40.39
  Bottom 0.61: v77.22,40.39 75.44,42.16 75.44,54.86 74.17,56.13 67.82,56.13 66.8,55.12 65.36,55.12 CONFIG.4 | PC.K 94.03,35.07 92.2,36.9 v92.2,40.39
N$31
  Bottom 0.61: KIT1.D- JP_RIGHT.9
N$32
  Bottom 0.61: KIT1.D+ JP_RIGHT.10
N$33
  Bottom 0.61: C1_MAX.+ 34.04,32.26 IC1.1
N$34
  Bottom 0.61: C1_MAX.- 32.51,37.34 IC1.3
N$35
  Bottom 0.61: C2_MAX.- 34.29,42.42 IC1.5
N$36
  Bottom 0.61: IC1.4 29.21,40.13 C2_MAX.+
N$37
  Bottom 0.61: C4_MAX.+ 22.57,29.17 25.4,32 25.4,33.78 26.42,34.8 IC1.2
N$38
  Bottom 0.61: IC1.6 32.51,44.96 33.53,45.97 33.53,51.56 31.24,53.85 C3_MAX.-
N$39  (via drill 0.5 pad 1.42)
  Top 0.406: v78.92,98 v78.95,106.85
  Bottom 0.406: ENC_CON.5 87.88,123.83 78.95,114.92 v78.95,106.85 | JP_RIGHT.13 67.89,86.36 68.78,87.25 68.75,87.25 76.12,94.62 77.6,94.62 78.92,95.95 v78.92,98
  Bottom 0.61: KIT1.P$28 JP_RIGHT.13 | 67.89,86.36 R4.1
N$40
  Bottom 0.61: X1.2 16.91,35.71 18.29,37.08 21.08,37.08 IC1.14
N$41
  Bottom 0.61: IC1.13 17.27,39.88 15.75,38.35 9.11,38.35 X1.3
N$42  (via drill 0.5 pad 1.42)
  Top 0.406: v87.5,106.88 87.5,92.1 85.17,89.78 v84.75,89.78
  Bottom 0.406: v87.5,106.88 87.5,114.97 95,122.42 95,128.85 93.85,130 86.25,130 85.34,129.09 ENC_CON.4 | v84.75,89.78 82.72,89.78 81.53,88.58 79.58,88.58 73.62,82.65 73.62,78 68.92,73.3 66.03,73.3 JP_RIGHT.18
  Bottom 0.61: KIT1.P$23 JP_RIGHT.18
N$44  (via drill 0.5 pad 1.42)  (1 unrouted)
  Top 0.406: v81.1,98.03 v81.08,106.85
  Bottom 0.406: ENC_CON.8 90.15,128.52 89.12,127.5 89.12,122.97 81.08,114.92 v81.08,106.85 | JP_RIGHT.14 67.57,83.82 77.12,93.38 78.9,93.38 81.1,95.58 v81.1,98.03
  Bottom 0.61: KIT1.P$27 JP_RIGHT.14
  Bottom 0.813: R3.1 67.78,83.8 67.6,83.8
N$45  (via drill 0.5 pad 1.42)
  Top 0.406: v83.2,106.85 v83.25,98.05
  Bottom 0.406: ENC_CON.7 90.42,122.17 83.2,114.95 v83.2,106.85 | v83.25,98.05 83.25,95.7 79.6,92.05 77.95,92.05 69.75,83.88 69.75,79.75 68.75,78.75 JP_RIGHT.16
  Bottom 0.61: KIT1.P$25 JP_RIGHT.16
N$46
  Bottom 0.61: U$1.PAAMA 7.18,18.9 5.1,18.9 2.7,16.5 2.7,2.5 5.4,-0.2 13.8,-0.2 14.6,-1 28.9,-1 30.15,-2.25 84.2,-2.25 90.9,4.45 90.9,14.85 92.5,16.75 93.75,16.75 94.75,17.75 94.75,28 94.92,28.18 93.6,29.5 R1.2
N$47  (via drill 0.5 pad 1.42)
  Top 0.406: v85.33,106.85 85.3,94.5 84.8,94 v84.8,93.6
  Bottom 0.406: ENC_CON.9 92.96,122.49 85.33,115 v85.33,106.85 | v84.8,93.6 83.8,93.6 80.6,90.4 78.67,90.4 71.58,83.28 71.58,78.9 68.67,76 65.59,76 JP_RIGHT.17
  Bottom 0.61: KIT1.P$24 JP_RIGHT.17
N$48
  Bottom 0.61: JP_LEFT.18 KIT1.VB
N$49
  Bottom 0.61: JP_LEFT.17 KIT1.NR
N$50
  Bottom 0.61: JP_LEFT.16 KIT1.P$5
N$52  (1 unrouted)
  Bottom 0.61: U$1.PAV 7.17,8.6 5.6,8.6 4.6,7.6 4.6,2.7 5.5,1.8 14.8,1.8 | R2.2 92.75,25.37 92.75,18.5 92.25,18 91.6,18 89.1,15.3 89.1,4.85 83.65,-0.6 30.9,-0.6 29.6,0.7 16,0.7 14.9,1.8
N$53
  Bottom 0.61: JP_LEFT.10 KIT1.P$11
N$54
  Bottom 0.61: JP_LEFT.9 KIT1.P$12
N$55
  Bottom 0.61: JP_LEFT.8 KIT1.P$13
N$57
  Bottom 0.61: JP_LEFT.7 KIT1.P$14
N$58  (via drill 0.5 pad 1.68)  (1 unrouted)
  Top 0.406: v61.9,121.25 v56,121.25 | v41.05,121.2 36.1,121.2 | 25.05,116.25 25.05,103.45 v24.95,103.35
  Top 0.813: 25.05,116.25 23.2,118.1 23.2,121.2 25.2,123.2 34,123.2 36,121.2 36.1,121.2
  Bottom 0.406: ENC_CON.3 85.34,125.69 74.6,114.95 73.35,114.95 67.05,121.25 v61.9,121.25 | 41.1,121.25 v41.05,121.2 | 28.45,108.7 OK1.2
  Bottom 0.61: v56,121.25 41.1,121.25 | v24.95,103.35 24.95,106.65 27,108.7 28.45,108.7
N$59
  Bottom 0.61: JP_LEFT.2 KIT1.P$19
N$60
  Bottom 0.61: JP_LEFT.1 KIT1.P$20
N$61
  Bottom 0.61: PWR_LED_R.2 96.01,69.07 96.01,64.49 97.85,62.65 97.85,60.45 97.05,59.65 95.01,59.65 PWR_LED.A
PTO  (1 unrouted)
  Bottom 0.61: KIT1.P$6 37.69,104.14 37.66,104.11 37.4,104.11 | JP_LEFT.15 36.35,104.14 34.86,105.63 34.86,110.2 33.08,111.98 31.31,111.98 30.29,113 22.67,113 21.4,114.27 21.4,122.19 22.4,123.3 25.7,123.3 26.7,123.3 28.03,124.63 CN_1.3
SIGN
  Bottom 0.61: KIT1.P$26 JP_RIGHT.15 63.02,81.28 62.8,81.5 62.04,81.5 60.01,83.53 60.01,127.91 61.95,129.85 65.46,129.85 65.47,129.86 66.74,128.59 66.74,127.15 CN_2.2
SIGN+  (via drill 0.5 pad 1.42)
  Top 0.406: v76.83,98 v76.83,106.85
  Bottom 0.406: ENC_CON.6 87.65,128.52 86.62,127.5 86.62,124.75 76.83,114.97 v76.83,106.85 | JP_RIGHT.12 68.15,88.9 75,95.75 76.62,95.75 76.8,96.15 v76.83,98
  Bottom 0.61: KIT1.P$29 JP_RIGHT.12
VCC  (via drill 0.5 pad 1.42, 0.5 pad 1.68, 0.6, 0.6 pad 1.68)  (2 unrouted)
  Top 0.61: v91.6,61.24 v78.76,61.24
  Bottom 0.406: 76.76,62.76 76.74,62.74
  Bottom 0.61: 33.15,117.93 33.77,117.32 33.85,115.28 35.34,114.3 JP_LEFT.19 KIT1.VIN 55.15,114.3 | 33.15,117.93 R16_ALM.2 | 9.9,99.5 8.92,98.52 6.28,98.52 3.9,96 3.9,87.9 3,87 3,81.5 3.9,80.6 3.9,74 2.38,72.98 2.38,65.44 3.76,64.06 IC2.3 10.87,64.06 13.72,61.21 13.72,55.99 C2_9V.+ 13.77,53.8 14.99,52.58 22.86,52.58 24.64,50.8 24.64,35.56 23.88,34.8 23.88,33.02 23.11,32.26 IC1.16 15.39,32.26 C4_MAX.- | 55.15,114.3 57.72,111.73 57.72,83.03 60.01,80.74 60.01,68.04 65.21,62.74 76.74,62.74 77.26,62.74 v78.76,61.24 | 78.84,70.2 76.76,68.11 76.76,62.76 | v91.6,61.24 91.6,57.4 93.35,55.65 96.25,55.65 97.5,54.4 97.5,51.1 | v32.92,121.3 32.92,118.2 33.15,117.93 | ENC_CON.2 80.48,128.52 77.5,131.5 60.5,131.5 58,129 58,117.15 55.15,114.3 | 18.42,130.4 18.42,130.22 | 36.4,127.9 36.4,124.8 v32.9,121.3 | 78.84,70.2 PWR_LED_R.1 80.1,70.6 82.1,72.6 82.1,74.5 85,77.4 85,81.12 R3.2 83.12,83.1 R4.2 | 97.5,51.1 97.5,42.45 | 97.5,42.45 97.5,34.05 95.92,32.53 PC.A | 97.5,51.1 96.65,50.25 95,50.25 ETH.A | BAUD.A 96.7,41.65 97.5,42.45
  Bottom 0.813: 9.9,99.5 9.85,105.15 6.05,108.6 4.98,109.62 3.6,111.1 3.12,111.67 3.12,118.18 4.07,119.18 4.09,128.68 5.79,130.38 15.39,130.37 18.42,130.4 | 18.42,130.22 21,130.2 34.1,130.2 36.4,127.9

### Text on the board
Bottom: CIME - 2012 | Ernesto Palacios